# Altium schematic sheet [1] - RING BAND.SchDoc: [2] - RING BAND
size A3; Author: Sawyer Rempel; Revision: A; SheetNumber: 1; SheetTotal: 2
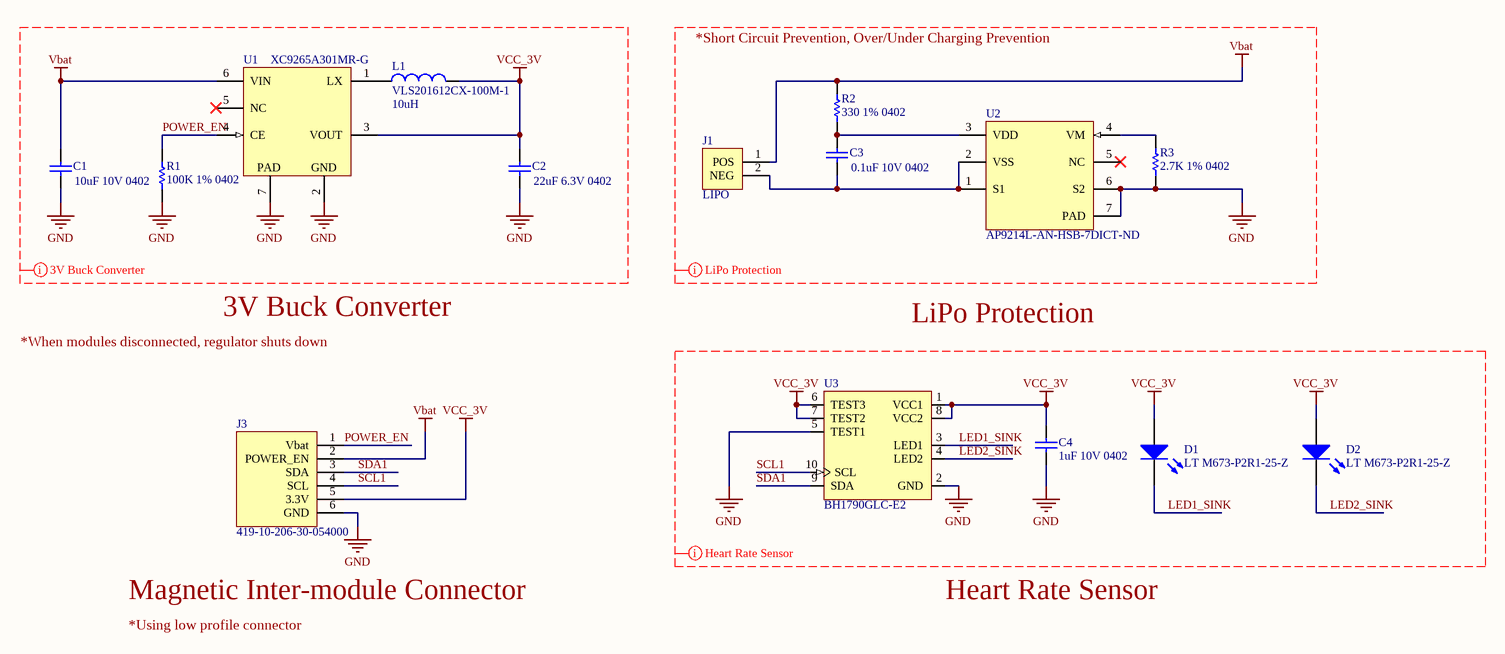
[diagram p0: [1] - RING BAND.SchDoc]

## Parts
C1  value 10uF 10V 0402  [0402 Capacitor]  (hidden comment: Cap)
C2  value 22uF 6.3V 0402  [0402 Capacitor]  (hidden comment: Cap)
C3  value 0.1uF 10V 0402  [0402 Capacitor]  (hidden comment: Cap)
C4  value 1uF 10V 0402  [0402 CAP BOT]  (hidden comment: Cap)
D1  LT M673-P2R1-25-Z  [LT M673-P2R1-25-Z]
D2  LT M673-P2R1-25-Z  [LT M673-P2R1-25-Z]
J1  LIPO  [LIPO]
J3  419-10-206-30-054000  [419-10-206-30-007000]
L1  VLS201612CX-100M-1  value 10uH  [VLS201612CX-100M-1]
R1  value 100K 1% 0402  [0402 RESISTOR]  (hidden comment: Res1)
R2  value 330 1% 0402  [0402 RESISTOR]  (hidden comment: Res1)
R3  value 2.7K 1% 0402  [0402 RESISTOR]  (hidden comment: Res1)
U1  XC9265A301MR-G  [XC9265A3014R-G]
U2  AP9214L-AN-HSB-7DICT-ND  [AP9214L-AN-HSB-7DICT-ND]
U3  BH1790GLC-E2  [BH1790GLC-E2]

## Nets
GND: C1.1 C2.1 C4.2 J3.6(GND) R1.2 R3.1 U1.2(GND) U1.7(GND) U2.6(S2) U2.7(PAD) U3.2(GND) U3.5(TEST1)
Vbat: C1.2 J1.1(POS) J3.2(POWER_EN) R2.1 U1.6(VIN)
VCC_3V: C2.2 C4.1 D1.1(A) D2.1(A) J3.5(3.3V) L1.2 U1.3(VOUT) U3.1(VCC1) U3.6(TEST3) U3.7(TEST2) U3.8(VCC2)
LED1_SINK: D1.2(K) U3.3(LED1)
LED2_SINK: D2.2(K) U3.4(LED2)
POWER_EN: J3.1(Vbat) R1.1 U1.4(CE)
SCL1: J3.4(SCL) U3.10(SCL)
SDA1: J3.3(SDA) U3.9(SDA)
NetC3_1: C3.1 J1.2(NEG) U2.1(S1) U2.2(VSS)
NetC3_2: C3.2 R2.2 U2.3(VDD)
NetL1_1: L1.1 U1.1(LX)
NetR3_2: R3.2 U2.4(VM)

Not connected (* = marked no-connect by the designer): U1 5(NC)*; U2 5(NC)*

## Layout directives
mark named Heart Rate Sensor: GND, LED1_SINK, LED2_SINK, SCL1, SDA1, VCC_3V
mark named LiPo Protection: GND, Vbat
mark named 3V Buck Converter: GND, POWER_EN, Vbat, VCC_3V

## Notes on the sheet
- (near R2) *Short Circuit Prevention, Over/Under Charging Prevention
- 3V Buck Converter
- LiPo Protection
- *When modules disconnected, regulator shuts down
- Magnetic Inter-module Connector
- Heart Rate Sensor
- *Using low profile connector
- Human Computer Interaction Lab
- Drawn By:
- Size:
- A3
- Revision:
- Sheet:
- of
- (in symbol XC9265A3014R-G) PAD

## Library data of the parts
C1-C4 = Cap: Capacitor; Published: 8-Jun-2000; LatestRevisionDate: 17-Jul-2002; LatestRevisionNote: Re-released for DXP Platform.; Publisher: Altium Limited; PackageDescription: Radial Cap, Thru-Hole; 2 Leads; 0.3 in Pin Spacing; PackageReference: RAD-0.3
  C1: Digikey PN: 1276-1450-1-ND
  C2: Digikey PN: 1276-7090-1-ND
  C3: Digikey PN: 1276-1022-1-ND
  C4: Digikey PN: 1276-1076-1-ND
D1 D2 = LED1: Typical RED GaAs LED; Published: 8-Jun-2000; LatestRevisionDate: 08-Jul-2005; LatestRevisionNote: Mech Layer 1 removed.; PackageReference: LED-1; Publisher: Altium Limited; PackageDescription: LED; 2 Leads; Digikey PN: 475-2775-1-ND
J3 = 419-10-206-30-007000: Digikey PN: ED10787-ND
L1 = Inductor: Code_IEC: 1005; Published: 8-Jun-2000; LatestRevisionDate: 29-May-2009; LatestRevisionNote: IPC-7351 Footprint Added.; PackageReference: 0402-A; Publisher: Altium Limited; PackageDescription: Chip Inductor; Code_JEITA: 0402; Digikey PN: 445-172958-1-ND
R1-R3 = Res1: Resistor; Published: 8-Jun-2000; LatestRevisionDate: 17-Jul-2002; LatestRevisionNote: Re-released for DXP Platform.; PackageReference: AXIAL-0.3; Publisher: Altium Limited; PackageDescription: Axial Device, Thru-Hole; 2 Leads; 0.3 in Pin Spacing
  R1: Digikey PN: 311-100KLRCT-ND
  R2: Digikey PN: 311-330LRCT-ND
  R3: Digikey PN: 311-2.70KLRCT-ND
U1 = XC9265A3014R-G
U2 = AP9214L-AN-HSB-7DICT-ND: Digikey PN: AP9214L-AN-HSB-7DICT-ND
U3 = BH1790GLC-E2: Digikey PN: BH1790GLC-E2CT-ND